# Altium schematic sheet Rf_Ambient-Noise-Detector-Schematic.schdoc
size 211 x 137 mm
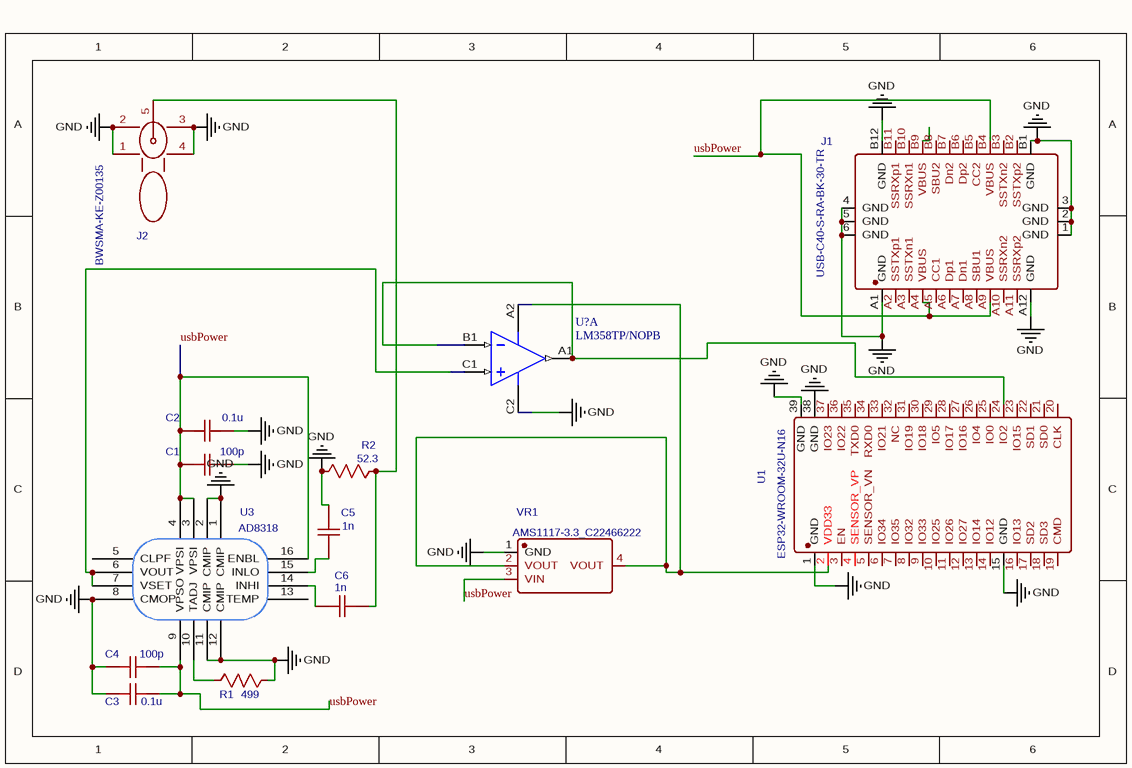
[diagram p0: Rf_Ambient-Noise-Detector-Schematic.schdoc]

## Parts
C1  100p  [C0603]
C2  0.1u  [C0603]
C3  0.1u  [C0603]
C4  100p  [C0603]
C5  1n  [C0603]
C6  1n  [C0603]
J1  USB-C40-S-RA-BK-30-TR  [USB-C-SMD_USB-C40-S-RA-BK-30-TR]
J2  BWSMA-KE-Z00135  [SMA-TH_BWSMA-KE-Z001]
R1  499  [R0603]
R2  52.3  [R0603]
U1  ESP32-WROOM-32U-N16  [WIFI-SMD_ESP32-WROOM-32UE]
U3  AD8318  [AD8318]
U?  LM358TP/NOPB  [YPB0008AAAA]  (part A of 2)
VR1  AMS1117-3.3_C22466222  [SOT-223-3_L6.5-W3.4-P2.30-LS7.0-BR]

## Nets
GND: C1.1 C2.1 C3.2 C4.2 C5.1 J1.1(GND) J1.2(GND) J1.3(GND) J1.4(GND) J1.5(GND) J1.6(GND) J1.A1(GND) J1.A12(GND) J1.B1(GND) J1.B12(GND) J2.1 J2.2 J2.3 J2.4 R1.2 R2.2 U1.1(GND) U1.15(GND) U1.38(GND) U1.39(GND) U3.1(CMIP) U3.2(CMIP) U3.8(CMOP) U3.11(CMIP) U3.12(CMIP) U?.C2(GND) VR1.1(GND)
usbPower: C1.2 C2.2 C3.1 C4.1 J1.A4(VBUS) J1.A9(VBUS) J1.B4(VBUS) U3.3(VPSI) U3.4(VPSI) U3.9(VPSO) U3.16(ENBL) VR1.3(VIN)
NetC5_2: C5.2 U3.15(INLO)
NetC6_1: C6.1 J2.5 R2.1
NetC6_2: C6.2 U3.14(INHI)
NetR1_1: R1.1 U3.10(TADJ)
NetU1_2: U1.2(VDD33) U?.A2(V+) VR1.2(VOUT) VR1.4(VOUT)
NetU1_24: U1.24(IO2) U?.A1(OUTA) U?.B1(INA-)
NetU3_6: U3.6(VOUT) U3.7(VSET) U?.C1(INA+)

Not connected (* = marked no-connect by the designer): J1 A2(SSTXp1) A3(SSTXn1) A5(CC1) A6(Dp1) A7(Dn1) A8(SBU1) A10(SSRXn2) A11(SSRXp2) B2(SSTXp2) B3(SSTXn2) B5(CC2) B6(Dp2) B7(Dn2) B8(SBU2) B9(VBUS) B10(SSRXn1) B11(SSRXp1); U1 3(EN) 4(SENSOR_VP) 5(SENSOR_VN) 6(IO34) 7(IO35) 8(IO32) 9(IO33) 10(IO25) 11(IO26) 12(IO27) 13(IO14) 14(IO12) 16(IO13) 17(SD2) 18(SD3) 19(CMD) 20(CLK) 21(SD0) 22(SD1) 23(IO15) 25(IO0) 26(IO4) 27(IO16) 28(IO17) 29(IO5) 30(IO18) 31(IO19) 32(NC) 33(IO21) 34(RXD0) 35(TXD0) 36(IO22) 37(IO23); U3 5(CLPF) 13(TEMP)

## Library data of the parts
C1 C4 = 100p: nameAlias: Value(F); Contributor: LCEDA_Lib; spicePre: C; spiceSymbolName: C_0603_US
C2 C3 = 0.1u: nameAlias: Value(F); Contributor: LCEDA_Lib; spicePre: C; spiceSymbolName: C_0603_US
C5 C6 = 1n: nameAlias: Value(F); Contributor: LCEDA_Lib; spicePre: C; spiceSymbolName: C_0603_US
J1 = USB-C40-S-RA-BK-30-TR: Manufacturer: ADAM TECH; Contributor: lcsc; Supplier: LCSC; Supplier Part: C7095252; Manufacturer Part: USB-C40-S-RA-BK-30-TR; JLCPCB Part Class: Extended Part; spicePre: U; spiceSymbolName: USB-C40-S-RA-BK-30-TR
J2 = BWSMA-KE-Z00135: Manufacturer: LX(连欣科技); Manufacturer Part: SMA-KWE/KE-135; Contributor: lcsc; Supplier: LCSC; Supplier Part: C42463336; JLCPCB Part Class: Extended Part; spicePre: R; spiceSymbolName: BWSMA-KE-Z00135
R1 = 499: nameAlias: Value(Ω); Contributor: LCEDA_Lib; spicePre: R; spiceSymbolName: R_0603_US
R2 = 52.3: nameAlias: Value(Ω); Contributor: LCEDA_Lib; spicePre: R; spiceSymbolName: R_0603_US
U1 = ESP32-WROOM-32U-N16: Manufacturer: null; Manufacturer Part: ESP32-WROOM-32U(16MB); Contributor: lcsc; Supplier: LCSC; Supplier Part: C2973674; JLCPCB Part Class: Extended Part; spicePre: U; spiceSymbolName: ESP32-WROOM-32U-N16
U3 = AD8318: Manufacturer: Analog Devices; Manufacturer P/N: AD8318ACPZ-REEL7; Unit Cost: 6.7165; Contributor: kpokigo; Distributor 1: Digi-Key; Distributor 1 P/N: AD8318ACPZ-REEL7TR-ND; Manufacturer Datasheet: http://www.analog.com/media/en/technical-documentation/data-sheets/AD8318.pdf; Manufacturer URL: www.analog.com; Notes: *; Manufacturer 1: Analog Devices; Manufacturer 1 Datasheet: http://www.analog.com/media/en/technical-documentation/data-sheets/AD8318.pdf; Manufacturer 1 P/N: AD8318ACPZ-REEL7; Manufacturer 1 URL: www.analog.com; spicePre: U; spiceSymbolName: AD8318
U? = CMP-0055-00262-3: Low Power Dual Operational Amplifier, 8-pin Micro SMD, Pb-Free; Manufacturer: Texas Instruments; High-Reliability: Y; PowerWise: N; CompType: Amplifiers; PackageTopMarking: XVA*I 07; RoHS: Y; ComponentLink1Description: Datasheet URL; ComponentLink1URL: http://www.ti.com/general/docs/lit/getliterature.tsp?genericPartNumber=LM358-N&fileType=pdf; PackageDescription: Thin Micro SMD, 8 Bump, 0.5mm Pitch; Code_JEDEC: MO-211-BC; Package Reference: YPB0008AAAA; PinCount: 8; PartNumber: LM358TP/NOPB
VR1 = AMS1117-3.3_C22466222: Manufacturer: TDSEMIC(拓电半导体); Contributor: lcsc; Supplier: LCSC; Supplier Part: C22466222; Manufacturer Part: AMS1117-3.3; JLCPCB Part Class: Extended Part; spicePre: U; spiceSymbolName: AMS1117-3.3_C22466222